# EAGLE design BendulumClockShield (EAGLE 6.5.0)
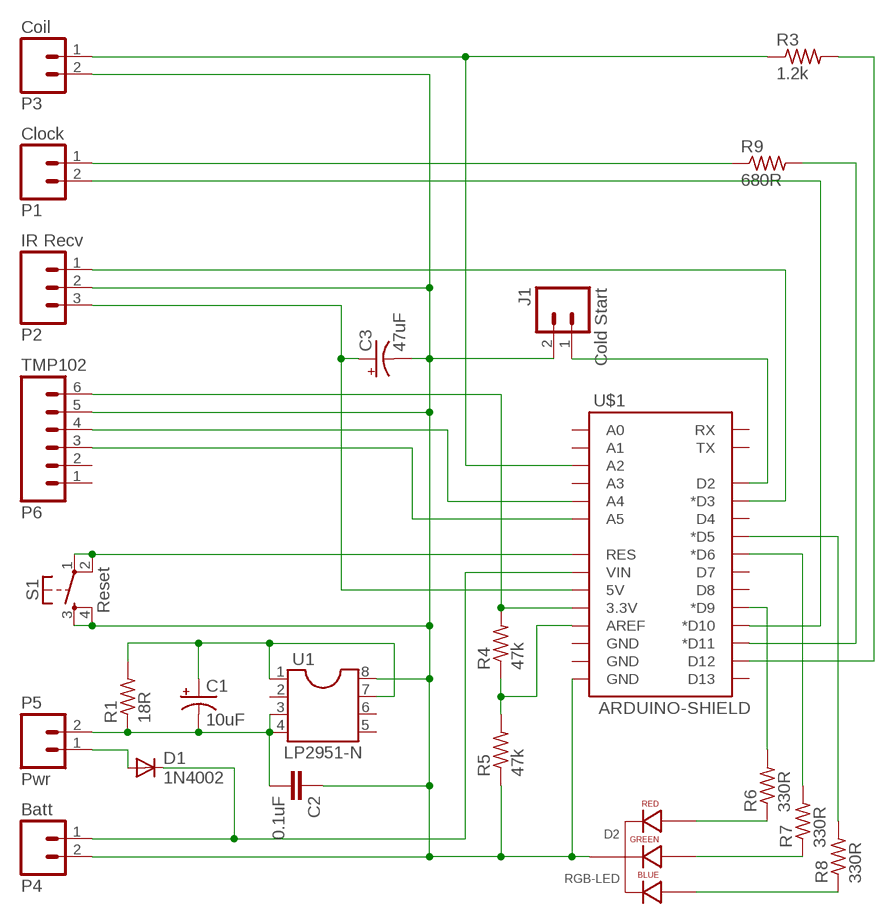
[diagram p0: schematic, sheet 1]

## Parts
C1  10uF  10UF-25V-20%(PTH)  [CPOL-RADIAL-10UF-25V]
C2  0.1uF  CAPPTH1  [CAP-PTH-5MM]
C3  47uF  10UF-25V-20%(PTH)  [CPOL-RADIAL-10UF-25V]
D1  1N4002  DIODE  [DIODE-1N4001-KIT]
D2  RGB-LED  LED-RGB-CC-THRUDIFFUSE  [LED-RGB-THRU]
J1  Cold Start  M02PTH  [1X02]
P1  Clock  M02PTH  [1X02]
P2  IR Recv  M03PTH  [1X03]
P3  Coil  M02PTH  [1X02]
P4  Batt  M02PTH  [1X02]
P5  Pwr  M02PTH  [1X02]
R1  18R  R-US_  [AXIAL-0.4]
R3  1.2k  R-US_  [AXIAL-0.4]
R4  47k  R-US_  [AXIAL-0.4]
R5  47k  R-US_  [AXIAL-0.4]
R6  330R  R-US_  [AXIAL-0.4]
R7  330R  R-US_  [AXIAL-0.4]
R8  330R  R-US_  [AXIAL-0.4]
R9  680R  R-US_  [AXIAL-0.4]
S1  Reset  TAC_SWITCHPTH  [TACTILE-PTH]
TMP102  P6  M06SIP  [1X06]
U1  LP2951-N  [SOCKET-08]
U$1  ARDUINO-SHIELD  [DUEMILANOVE_SHIELD]

## Nets
GND: C2.1 C3.2(-) D2.2(CATHODE) J1.2 P2.2 P3.2 P4.2 R5.P$1 S1.3 S1.4 TMP102.5 U1.8(INPUT) U$1.GND@0(GND)
N$1: D1.A P5.1
N$2: D1.C P4.1 U$1.VIN
N$3: C1.2(-) C2.2 P5.2 R1.P$1 U1.3(SHUTDOWN) U1.4(GND)
N$4: S1.1 S1.2 U$1.RES
N$5: R6.P$2 U$1.D9(*D9)
N$6: P3.1 R3.P$1 U$1.A2
N$7: R4.P$2 TMP102.6 U$1.3.3V
N$8: R3.P$2 U$1.D12
N$9: TMP102.4 U$1.A4
N$10: J1.1 U$1.D2
N$11: R4.P$1 R5.P$2 U$1.AREF
N$12: R7.P$2 U$1.D6(*D6)
N$13: R8.P$2 U$1.D5(*D5)
N$14: P2.1 U$1.D3(*D3)
N$15: C3.1(+) P2.3 U$1.5V
N$16: TMP102.3 U$1.A5
N$17: D2.1(RED_ANODE) R6.P$1
N$18: D2.3(GREEN_ANODE) R7.P$1
N$19: D2.4(BLUE_ANODE) R8.P$1
N$21: P1.2 U$1.D10(*D10)
N$22: P1.1 R9.P$1
N$23: R9.P$2 U$1.D11(*D11)
U1: C1.1(+) R1.P$2 U1.1(OUTPUT) U1.7(FEEDBACK)
Unconnected: TMP102.1 TMP102.2 U1.2(SENSE) U1.5(NOT-ERROR) U1.6(V0-TAP) U$1.A0 U$1.A1 U$1.A3 U$1.D4 U$1.D7 U$1.D8 U$1.D13 U$1.GND@1(GND) U$1.GND@2(GND) U$1.RX U$1.TX

## Library data of the parts
C1 C3 = SparkFun-Capacitors:10UF-25V-20%(PTH): CAP-08440; PROD_ID: CAP-08440
C2 = SparkFun-Capacitors:CAP: Capacitor Standard 0603 ceramic capacitor, and 0.1" leaded capacitor.
D1 = SparkFun-DiscreteSemi:DIODE: Diode These are standard reverse protection diodes and small signal diodes. SMA package can handle up to about 1A. SOD-323 can handle about 200mA. What the SOD-323 package when ordering, there are some mfgs out there that are 5-pin packages.
D2 = dehne:LED-RGB-CC-THRU: RGB Through-hole common cathode LED wide spacing for hand soldering; PROD_ID: DIO-09434
J1 P1 P3-P5 = dehne:M02: Standard 2-pin 0.1" header. Use with - straight break away headers ( PRT-00116) - right angle break away headers (PRT-00553) - swiss pins (PRT-00743) - machine pins (PRT-00117) - female headers (PRT-00115) Molex polarized connector foot print use with: PRT-08233 with associated crimp pins and housings. 2.54_SCREWTERM for use with PRT-10571. 3.5mm Screw Terminal footprints for PRT-08084 5mm Screw Terminal footprints for use with PRT-08433
P2 = dehne:M03: Header 3 Standard 3-pin 0.1" header. Use with straight break away headers (SKU : PRT-00116), right angle break away headers (PRT-00553), swiss pins (PRT-00743), machine pins (PRT-00117), and female headers (PRT-00115). Molex polarized connector foot print use with SKU : PRT-08232 with associated crimp pins and housings.
R1 R3-R9 = dehne:R-US_: RESISTOR, American symbol
S1 = dehne:TAC_SWITCH: Momentary Switch Button commonly used for reset or general input. Spark Fun Electronics SKU : COM-00097 SMT- SWCH-08247
TMP102 = dehne:M06: Header 6 Standard 6-pin 0.1" header. Use with straight break away headers (SKU : PRT-00116), right angle break away headers (PRT-00553), swiss pins (PRT-00743), machine pins (PRT-00117), and female headers (PRT-00115). Molex polarized connector foot print use with SKU : PRT-08094 with associated crimp pins and housings. NOTES ON THE VARIANTS LOCK and LOCK_LONGPADS... This footprint was designed to help hold the alignment of a through-hole component (i.e. 6-pin header) while soldering it into place. You may notice that each hole has been shifted either up or down by 0.005 of an inch from it's more standard position (which is a perfectly straight line). This slight alteration caused the pins (the squares in the middle) to touch the edges of the holes. Because they are alternating, it causes a "brace" to hold the component in place. 0.005 has proven to be the perfect amount of "off-center" position when using our standard breakaway headers. Although looks a little odd when you look at the bare footprint, once you have a header in there, the alteration is very hard to notice. Also,if you push a header all the way into place, it is covered up entirely on the bottom side. This idea of altering the position of holes to aid alignment will be further integrated into the Sparkfun Library for other footprints. It can help hold any component with 3 or more connection pins.
U1 = dehne:LP2951-N: LP2951-N 100 mA, Low Power Low Dropout Voltage Regulator
U$1 = dehne:ARDUINO-SHIELD: Arduino Shield

## Board
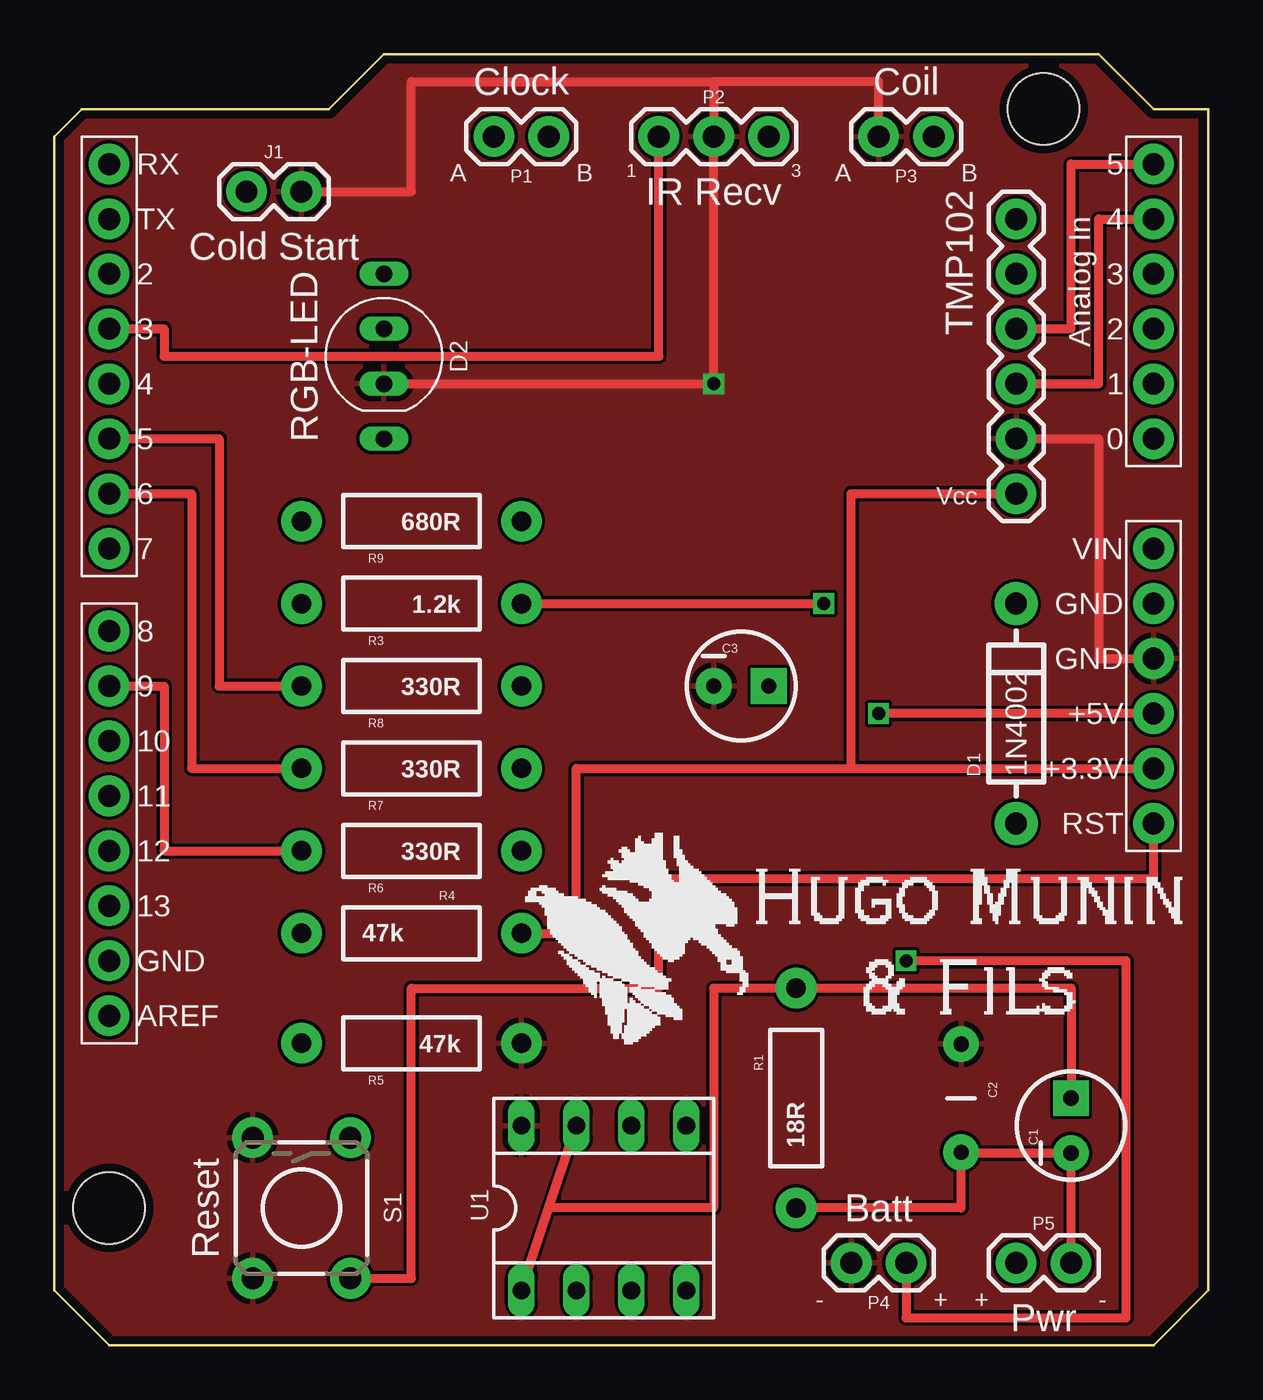
[diagram p1: board, top side]
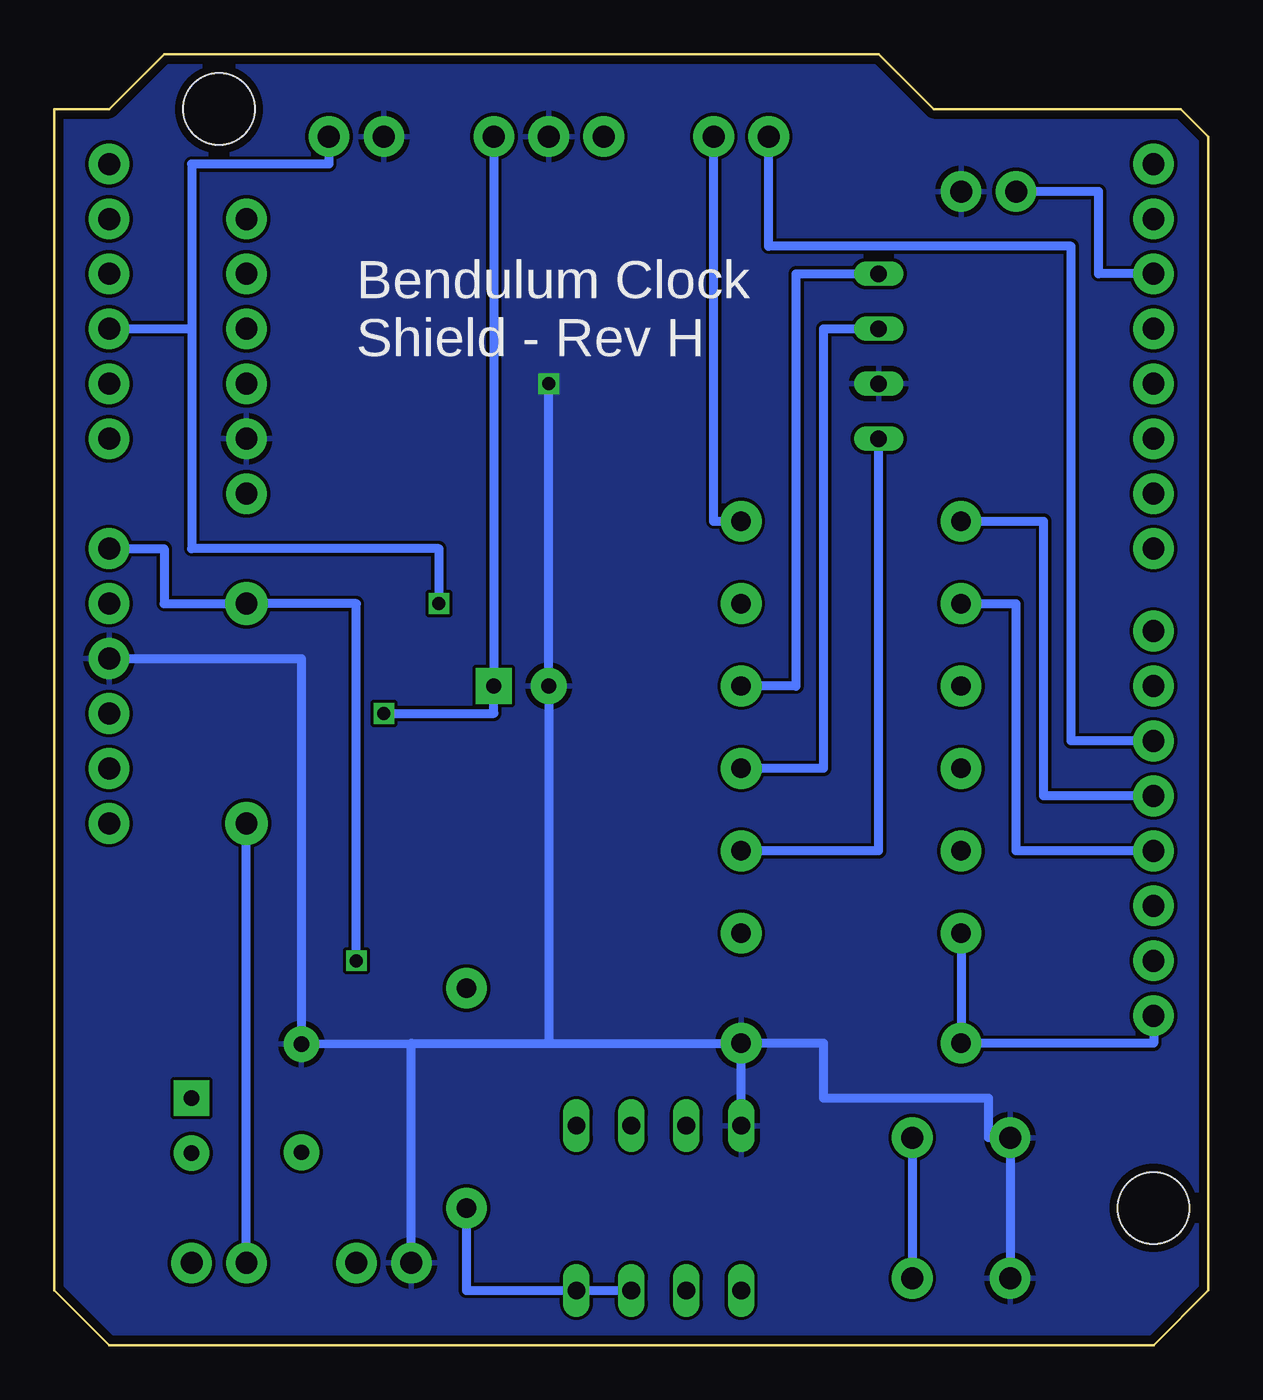
[diagram p2: board, bottom side, seen from below]

Size 53.34 x 59.69 mm. Coordinates in mm from the lower left corner, seen from the top.
Copper layers (1*16): Top 0.0356mm / dielectric 1.5011mm / Bottom 0.0356mm
Design rules "LaenPCBOrder": minimum track width 6mil, minimum drill 13mil, track to track 6mil, track to pad 6mil, pad to pad 6mil, via to via 6mil, smd to smd 6mil, copper to edge 15mil, drill to drill 6mil, minimum pad ring 7mil, minimum via ring 7mil, stop-mask expansion 4mil, vias tented up to drill 0mil, thermal gap 10mil

### Footprints (pad centres in the part's own frame; a part is rotated, then mirrored left to right if it is on the bottom)
CPOL-RADIAL-10UF-25V = drill 0.7 pad 1.651 square: 1 1.27,0 | drill 0.7 pad 1.651: 2 -1.27,0
CAP-PTH-5MM = drill 0.7 pad 1.651: 1 -2.5,0; 2 2.5,0
DIODE-1N4001-KIT = drill 1 pad 1.981: A -5.08,0; C 5.08,0
LED-RGB-THRU = drill 0.762 pad 0.889 long: 1 3.81,0; 2 1.27,0; 3 -1.27,0; 4 -3.81,0
1X02 = drill 1.016 pad 1.88: 1 0,0; 2 2.54,0
1X03 = drill 1.016 pad 1.88: 1 0,0; 2 2.54,0; 3 5.08,0
AXIAL-0.4 = drill 0.9 pad 1.88: P$1 -5.08,0; P$2 5.08,0
TACTILE-PTH = drill 1.016 pad 1.88: 1 -3.251,2.261; 2 3.251,2.261; 3 -3.251,-2.261; 4 3.251,-2.261
1X06 = drill 1.016 pad 1.88: 1 0,0; 2 2.54,0; 3 5.08,0; 4 7.62,0; 5 10.16,0; 6 12.7,0
SOCKET-08 = drill 0.813 long: 1 -3.81,-3.81; 2 -1.27,-3.81; 3 1.27,-3.81; 4 3.81,-3.81; 5 3.81,3.81; 6 1.27,3.81; 7 -1.27,3.81; 8 -3.81,3.81
DUEMILANOVE_SHIELD = drill 1.016 pad 1.88: 3.3V 50.8,26.67; 5V 50.8,29.21; A0 50.8,41.91; A1 50.8,44.45; A2 50.8,46.99; A3 50.8,49.53; A4 50.8,52.07; A5 50.8,54.61; AREF 2.54,15.24; D2 2.54,49.53; D3 2.54,46.99; D4 2.54,44.45; D5 2.54,41.91; D6 2.54,39.37; D7 2.54,36.83; D8 2.54,33.02; D9 2.54,30.48; D10 2.54,27.94; D11 2.54,25.4; D12 2.54,22.86; D13 2.54,20.32; GND@0 50.8,31.75; GND@1 50.8,34.29; GND@2 2.54,17.78; RES 50.8,24.13; RX 2.54,54.61; TX 2.54,52.07; VIN 50.8,36.83 | hole 3.302: 45.72,57.15; 2.54,6.35

### Placement (x,y rotation side)
C1  46.99,10.16 90 top
C2  41.91,11.43 270 top
C3  31.75,30.48 0 top
D1  44.45,29.21 90 top
D2  15.24,45.72 270 top
J1  8.89,53.34 0 top
P1  22.86,55.88 180 top
P2  27.94,55.88 0 top
P3  40.64,55.88 180 top
P4  39.37,3.81 180 top
P5  44.45,3.81 0 top
R1  34.29,11.43 90 top
R3  16.51,34.29 180 top
R4  16.51,19.05 0 top
R5  16.51,13.97 180 top
R6  16.51,22.86 180 top
R7  16.51,26.67 180 top
R8  16.51,30.48 180 top
R9  16.51,38.1 180 top
S1  11.43,6.35 270 top
TMP102  44.45,52.07 270 top
U1  25.4,6.35 0 top
U$1  0,0 0 top
U$2  [HMF-LOGO]  38.61,18.29 0 top

### Tracks (layer width: path | path; a pad name or v marks a point on that pad's centre or on a via)
GND  (via drill 0.6)
  Top 0.406: P3.2 38.1,58.42 30.48,58.42 | 30.48,58.42 P2.2 v30.48,44.45 D2.2 | J1.2 16.51,53.34 16.51,58.42 30.48,58.42 | TMP102.5 48.26,41.91 48.26,31.75 U$1.GND@0
  Bottom 0.406: U$1.GND@0 41.91,31.75 C2.1 36.83,13.97 | P4.2 36.83,13.97 | U1.8 R5.P$1 | 36.83,13.97 30.48,13.97 | 30.48,13.97 R5.P$1 | R5.P$1 17.78,13.97 17.78,11.43 10.16,11.43 10.16,9.6 S1.3 S1.4 | v30.48,44.45 C3.2 30.48,13.97
  pour Bottom: 0,2.54 2.54,0 50.8,0 53.34,2.54 53.34,57.15 50.8,57.15 48.26,59.69 15.24,59.69 12.7,57.15 1.27,57.15 0,55.88
  pour Top: 0,2.54 2.54,0 50.8,0 53.34,2.54 53.34,57.15 50.8,57.15 48.26,59.69 15.24,59.69 12.7,57.15 1.27,57.15 0,55.88
N$1
  Bottom 0.406: P5.1 D1.A
N$2  (via drill 0.6)
  Top 0.406: P4.1 39.37,1.27 49.53,1.27 49.53,17.78 v39.37,17.78
  Bottom 0.406: v39.37,17.78 39.37,34.29 D1.C 48.26,34.29 48.26,36.83 U$1.VIN
N$3
  Top 0.406: 41.91,8.89 41.91,6.35 R1.P$1 | P5.2 C1.2 41.91,8.89 | 41.91,8.89 C2.2
  Bottom 0.406: R1.P$1 34.29,2.54 U1.4 U1.3
N$4
  Top 0.406: S1.2 16.51,3.1 16.51,16.51 27.94,16.51 27.94,21.59 50.8,21.59 U$1.RES
  Bottom 0.406: S1.1 S1.2
N$5
  Top 0.406: U$1.D9 5.08,30.48 5.08,22.86 R6.P$2
N$6  (via drill 0.6)
  Top 0.406: R3.P$1 v35.56,34.29
  Bottom 0.406: U$1.A2 46.99,46.99 | 46.99,46.99 46.99,36.83 35.56,36.83 v35.56,34.29 | P3.1 40.64,54.61 46.99,54.61 46.99,46.99
N$7
  Top 0.406: 36.83,26.67 U$1.3.3V | R4.P$2 24.13,19.05 24.13,26.67 36.83,26.67 | 36.83,26.67 36.83,39.37 TMP102.6
N$8
  Bottom 0.406: U$1.D12 8.89,22.86 8.89,34.29 R3.P$2
N$9
  Top 0.406: TMP102.4 48.26,44.45 48.26,52.07 U$1.A4
N$10
  Bottom 0.406: U$1.D2 5.08,49.53 5.08,53.34 J1.1
N$11
  Bottom 0.406: R4.P$1 R5.P$2 2.54,13.97 U$1.AREF
N$12
  Top 0.406: U$1.D6 6.35,39.37 6.35,26.67 R7.P$2
N$13
  Top 0.406: U$1.D5 7.62,41.91 7.62,30.48 R8.P$2
N$14
  Top 0.406: P2.1 27.94,45.72 5.08,45.72 5.08,46.99 U$1.D3
N$15  (via drill 0.6)
  Top 0.406: U$1.5V v38.1,29.21
  Bottom 0.406: v38.1,29.21 33.02,29.21 C3.1 P2.3
N$16
  Top 0.406: TMP102.3 46.99,46.99 46.99,54.61 U$1.A5
N$17
  Bottom 0.406: D2.1 15.24,22.86 R6.P$1
N$18
  Bottom 0.406: R7.P$1 17.78,26.67 17.78,46.99 D2.3
N$19
  Bottom 0.406: D2.4 19.05,49.53 19.05,30.48 R8.P$1
N$21
  Bottom 0.406: U$1.D10 6.35,27.94 6.35,50.8 20.32,50.8 P1.2
N$22
  Bottom 0.406: P1.1 22.86,38.1 R9.P$1
N$23
  Bottom 0.406: U$1.D11 7.62,25.4 7.62,38.1 R9.P$2
U1
  Top 0.406: C1.1 46.99,16.51 R1.P$2 30.48,16.51 30.48,6.35 22.86,6.35 | 22.86,6.35 U1.7 | U1.1 22.86,6.35

### Text on the board
_tsilk: A | B | A | B | Vcc | - | + | + | -
_bsilk: Bendulum Clock / Shield - Rev H